# Altium schematic sheet CapProtector.SchDoc
size A4
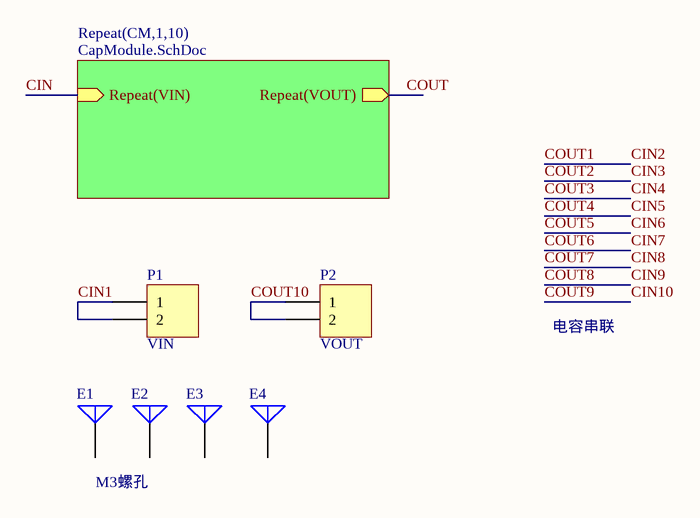
[diagram p0: CapProtector.SchDoc]

## Parts
E1  Antenna  [M3x4_N]  (value not drawn)
E2  Antenna  [M3x4_N]  (value not drawn)
E3  Antenna  [M3x4_N]  (value not drawn)
E4  Antenna  [M3x4_N]  (value not drawn)
P1  VIN  [XT30U-M]
P2  VOUT  [XT30U-F]

## Sub-sheets
Repeat(CM,1,10) = CapModule.SchDoc: Repeat(VIN) (in), Repeat(VOUT) (out)

## Nets
CIN: sheet Repeat(CM,1,10)/Repeat(VIN)
CIN1: P1.1 P1.2
COUT: sheet Repeat(CM,1,10)/Repeat(VOUT)
COUT10: P2.1 P2.2

Not connected (* = marked no-connect by the designer): E1 1(A); E2 1(A); E3 1(A); E4 1(A)

## Notes on the sheet
- 电容串联
- M3螺孔

## Library data of the parts
E1-E4 = Antenna: Generic Antenna; Published: 24-Mar-1999; LatestRevisionDate: 17-Jul-2002; LatestRevisionNote: Re-released for DXP Platform.; PackageReference: PIN1; Publisher: Altium Limited
P1 P2 = Header 2: Header, 2-Pin; LatestRevisionDate: 17-Jul-2002; LatestRevisionNote: Re-released for DXP Platform.; Publisher: Altium Limited